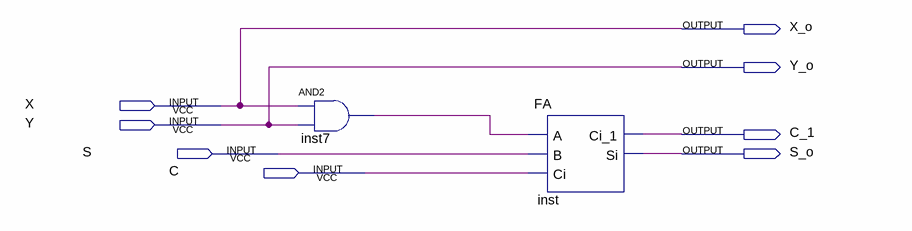
[diagram p0: schematic sheet]
// Quartus schematic signal_mult.bdf as structural Verilog: 2 symbols, 8 pins
module signal_mult (
  input  X,
  input  Y,
  input  S,
  input  C,
  output X_o,
  output Y_o,
  output C_1,
  output S_o
);

  wire inst7_out;

  and inst7 (inst7_out, X, Y);
  FA inst (.A(inst7_out), .B(S), .Ci(C), .Ci_1(C_1), .Si(S_o));

  assign X_o = X;
  assign Y_o = Y;
endmodule
